# Altium schematic sheet PWM_PPM_FMU_REV_2A.SchDoc: Cube Yellow and Cube Orange
size A3; Date: 18/08/2014 1:53:26 PM; Author: PR; DrawnBy: Philip Rowse; Engineer: Philip Rowse; Organization: ProfiCNC/Hex; Address3: VIC; Address4: Australia; Revision: A; SheetNumber: 7; SheetTotal: 10
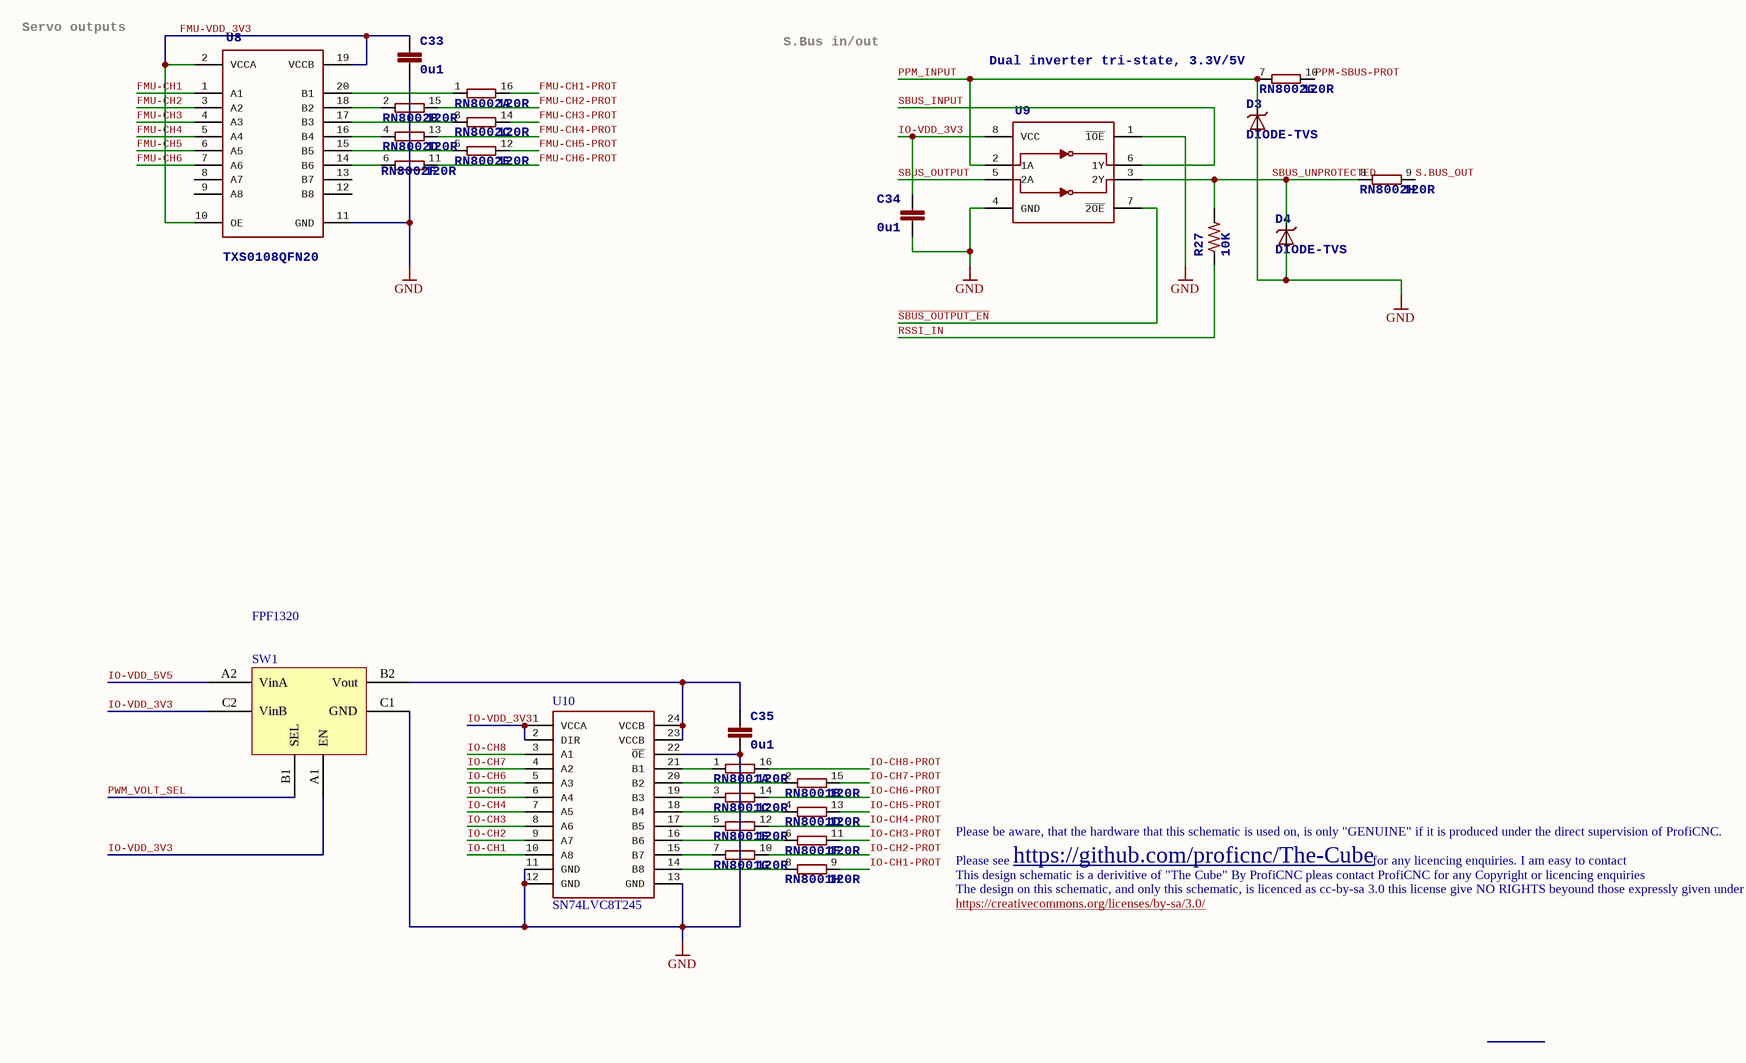
[diagram p0: PWM_PPM_FMU_REV_2A.SchDoc]

## Parts
C33  0u1  [0402-CAP]
C34  0u1  [0402-CAP]
C35  0u1  [0402-CAP]
D3  DIODE-TVS  [0402-TVS]
D4  DIODE-TVS  [0402-TVS]
R27  10K  [0402-RES]
RN8001  120R  [EXB2HV]  (parts A,B,C,D,E,F,G,H of 8)
RN8002  120R  [EXB2HV]  (parts A,B,C,D,E,F,G,H of 8)
SW1  FPF1320  [FPF1320]
U8  TXS0108QFN20  [QFN20-RGY]
U9  Dual inverter tri-state, 3.3V/5V  [TSSOP8_SOT505-2]
U10  SN74LVC8T245  [QFN24-RGY]

## Nets
GND: C33.P$2 C34.P$2 C35.P$2 D3.A D4.A SW1.C1(GND) U8.11(GND) U9.1(~{1OE}) U9.4(GND) U10.11(GND) U10.12(GND) U10.13(GND) U10.22(~{OE})
FMU-CH1: U8.1(A1)
FMU-CH1-PROT: RN8002.16
FMU-CH2: U8.3(A2)
FMU-CH2-PROT: RN8002.15
FMU-CH3: U8.4(A3)
FMU-CH3-PROT: RN8002.14
FMU-CH4: U8.5(A4)
FMU-CH4-PROT: RN8002.13
FMU-CH5: U8.6(A5)
FMU-CH5-PROT: RN8002.12
FMU-CH6: U8.7(A6)
FMU-CH6-PROT: RN8002.11
FMU-VDD_3V3: C33.P$1 U8.2(VCCA) U8.10(OE) U8.19(VCCB)
IO-CH1: U10.10(A8)
IO-CH1-PROT: RN8001.9
IO-CH2: U10.9(A7)
IO-CH2-PROT: RN8001.10
IO-CH3: U10.8(A6)
IO-CH3-PROT: RN8001.11
IO-CH4: U10.7(A5)
IO-CH4-PROT: RN8001.12
IO-CH5: U10.6(A4)
IO-CH5-PROT: RN8001.13
IO-CH6: U10.5(A3)
IO-CH6-PROT: RN8001.14
IO-CH7: U10.4(A2)
IO-CH7-PROT: RN8001.15
IO-CH8: U10.3(A1)
IO-CH8-PROT: RN8001.16
IO-VDD_3V3: C34.P$1 SW1.A1(EN) SW1.C2(VinB) U9.8(VCC) U10.1(VCCA) U10.2(DIR)
IO-VDD_5V5: SW1.A2(VinA)
PPM-SBUS-PROT: RN8002.10
PPM_INPUT: D3.C RN8002.7 U9.2(1A)
PWM_VOLT_SEL: SW1.B1(SEL)
RSSI_IN: R27.P$1
S.BUS_OUT: RN8002.9
~{SBUS_OUTPUT_EN}: U9.7(~{2OE})
SBUS_INPUT: U9.6(1Y)
SBUS_OUTPUT: U9.5(2A)
SBUS_UNPROTECTED: D4.C R27.P$2 RN8002.8 U9.3(2Y)
NetC35_P$1: C35.P$1 SW1.B2(Vout) U10.23(VCCB) U10.24(VCCB)
NetRN8001_1: RN8001.1 U10.21(B1)
NetRN8001_2: RN8001.2 U10.20(B2)
NetRN8001_3: RN8001.3 U10.19(B3)
NetRN8001_4: RN8001.4 U10.18(B4)
NetRN8001_5: RN8001.5 U10.17(B5)
NetRN8001_6: RN8001.6 U10.16(B6)
NetRN8001_7: RN8001.7 U10.15(B7)
NetRN8001_8: RN8001.8 U10.14(B8)
NetRN8002_1: RN8002.1 U8.20(B1)
NetRN8002_2: RN8002.2 U8.18(B2)
NetRN8002_3: RN8002.3 U8.17(B3)
NetRN8002_4: RN8002.4 U8.16(B4)
NetRN8002_5: RN8002.5 U8.15(B5)
NetRN8002_6: RN8002.6 U8.14(B6)

Not connected (* = marked no-connect by the designer): U8 8(A7) 9(A8) 12(B8) 13(B7)

## Notes on the sheet
- Servo outputs
- S.Bus in/out
- Please be aware, that the hardware that this schematic is used on, is only "GENUINE" if it is produced under the direct supervision of ProfiCNC.
- The design on this schematic, and only this schematic, is licenced as cc-by-sa 3.0 this license give NO RIGHTS beyound those expressly given under the terms of this license.
- This design schematic is a derivitive of "The Cube" By ProfiCNC pleas contact ProfiCNC for any Copyright or licencing enquiries
- https://creativecommons.org/licenses/by-sa/3.0/
- Please see
- https://github.com/proficnc/The-Cube
- for any licencing enquiries. I am easy to contact
- Drawn By:
- Verified for production by:
- Approved for release:
- Title
- Size:
- Date:
- A
- Number:
- Time:
- Revision:
- Sheet
- of
- File:

## Library data of the parts
C33-C35 = CAP0402: CAP CER 0.1UF 16V Y5V 0402; Value: 0u1
D3 D4 = DIODE-TVS: TVS DIODE 14VWM 40VC 0402; Value: 40v
R27 = RESISTOR0402-RES: RES 10K OHM 1/16W 1% 0402 SMD; Value: 10K
RN8001 RN8002 = 8R-NEXB2HV-220R: RES ARRAY 120 OHM 8 RES 1506; Value: 120R
U8 = TXS0108QFN20: IC XLATR VOLT-LVL 8B BDIR 20QFN
U9 = 74LVC2G240-TSSOP-8: IC INVERTER DUAL 4-INPUT 8TSSOP; Value: INV